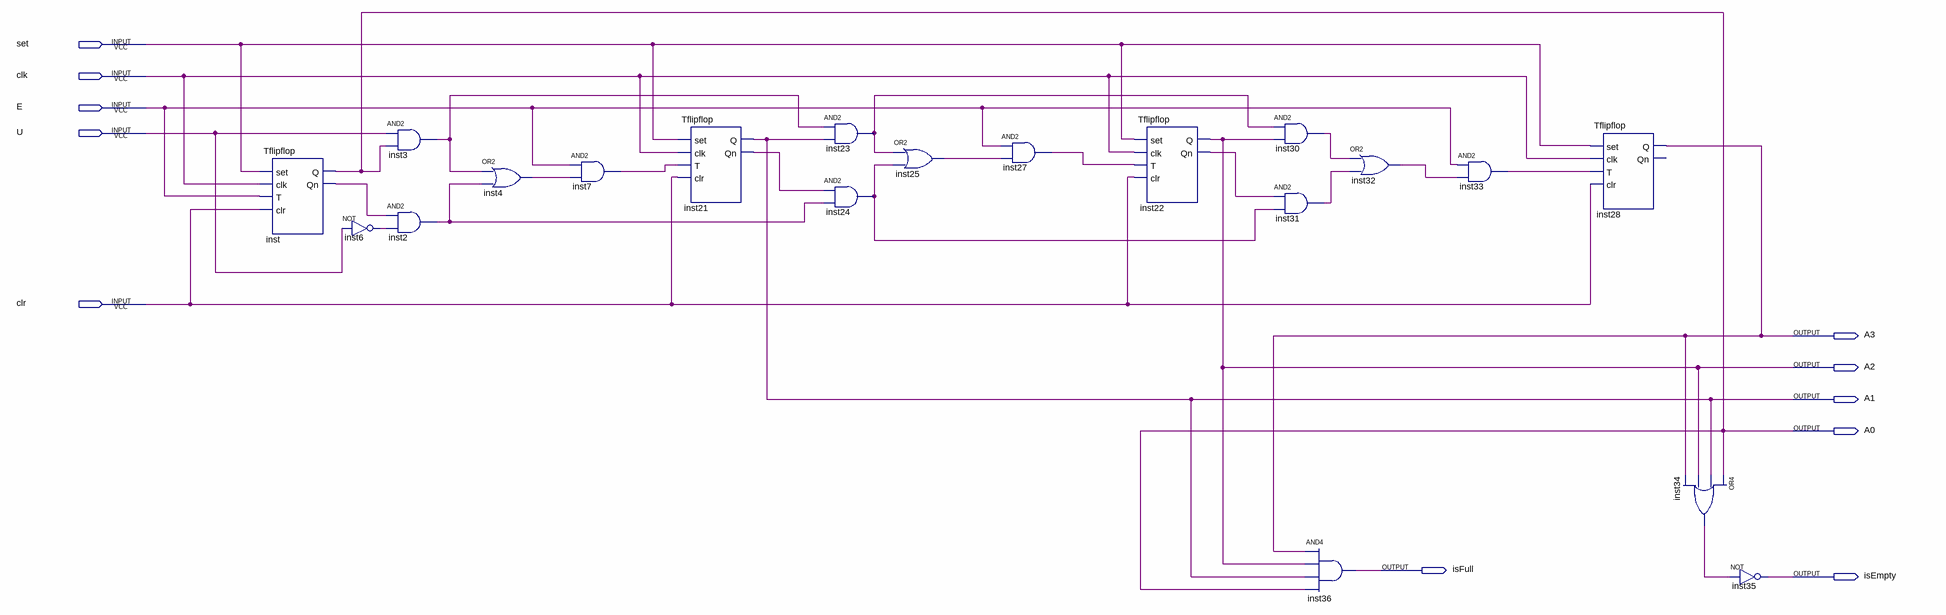
[diagram p0: schematic sheet]
// Quartus schematic 4bitCounter.bdf as structural Verilog: 20 symbols, 11 pins
module \4bitCounter  (
  input  set,
  input  clk,
  input  E,
  input  U,
  input  clr,
  output A3,
  output A2,
  output A1,
  output A0,
  output isFull,
  output isEmpty
);

  wire inst2_out, inst3_out, inst4_out, inst6_out, inst7_out, inst21_qn, inst22_qn, inst23_out, inst24_out,
       inst25_out, inst27_out, inst30_out, inst31_out, inst32_out, inst33_out, inst34_out, inst_qn;

  Tflipflop inst (.set(set), .clk(clk), .T(E), .clr(clr), .Q(A0), .Qn(inst_qn));
  not inst6 (inst6_out, U);
  and inst3 (inst3_out, U, A0);
  and inst2 (inst2_out, inst_qn, inst6_out);
  or inst4 (inst4_out, inst3_out, inst2_out);
  and inst7 (inst7_out, E, inst4_out);
  Tflipflop inst21 (.set(set), .clk(clk), .T(inst7_out), .clr(clr), .Q(A1), .Qn(inst21_qn));
  and inst23 (inst23_out, inst3_out, A1);
  and inst24 (inst24_out, inst21_qn, inst2_out);
  or inst25 (inst25_out, inst23_out, inst24_out);
  and inst27 (inst27_out, E, inst25_out);
  Tflipflop inst22 (.set(set), .clk(clk), .T(inst27_out), .clr(clr), .Q(A2), .Qn(inst22_qn));
  and inst30 (inst30_out, inst23_out, A2);
  and inst31 (inst31_out, inst22_qn, inst24_out);
  and inst36 (isFull, A3, A2, A1, A0);
  or inst32 (inst32_out, inst30_out, inst31_out);
  and inst33 (inst33_out, E, inst32_out);
  Tflipflop inst28 (.set(set), .clk(clk), .T(inst33_out), .clr(clr), .Q(A3));  // open: Qn
  or inst34 (inst34_out, A0, A1, A2, A3);
  not inst35 (isEmpty, inst34_out);
endmodule
